# Altium schematic sheet 主板_2.SchDoc
size A4; SheetNumber: 2; SheetTotal: 3
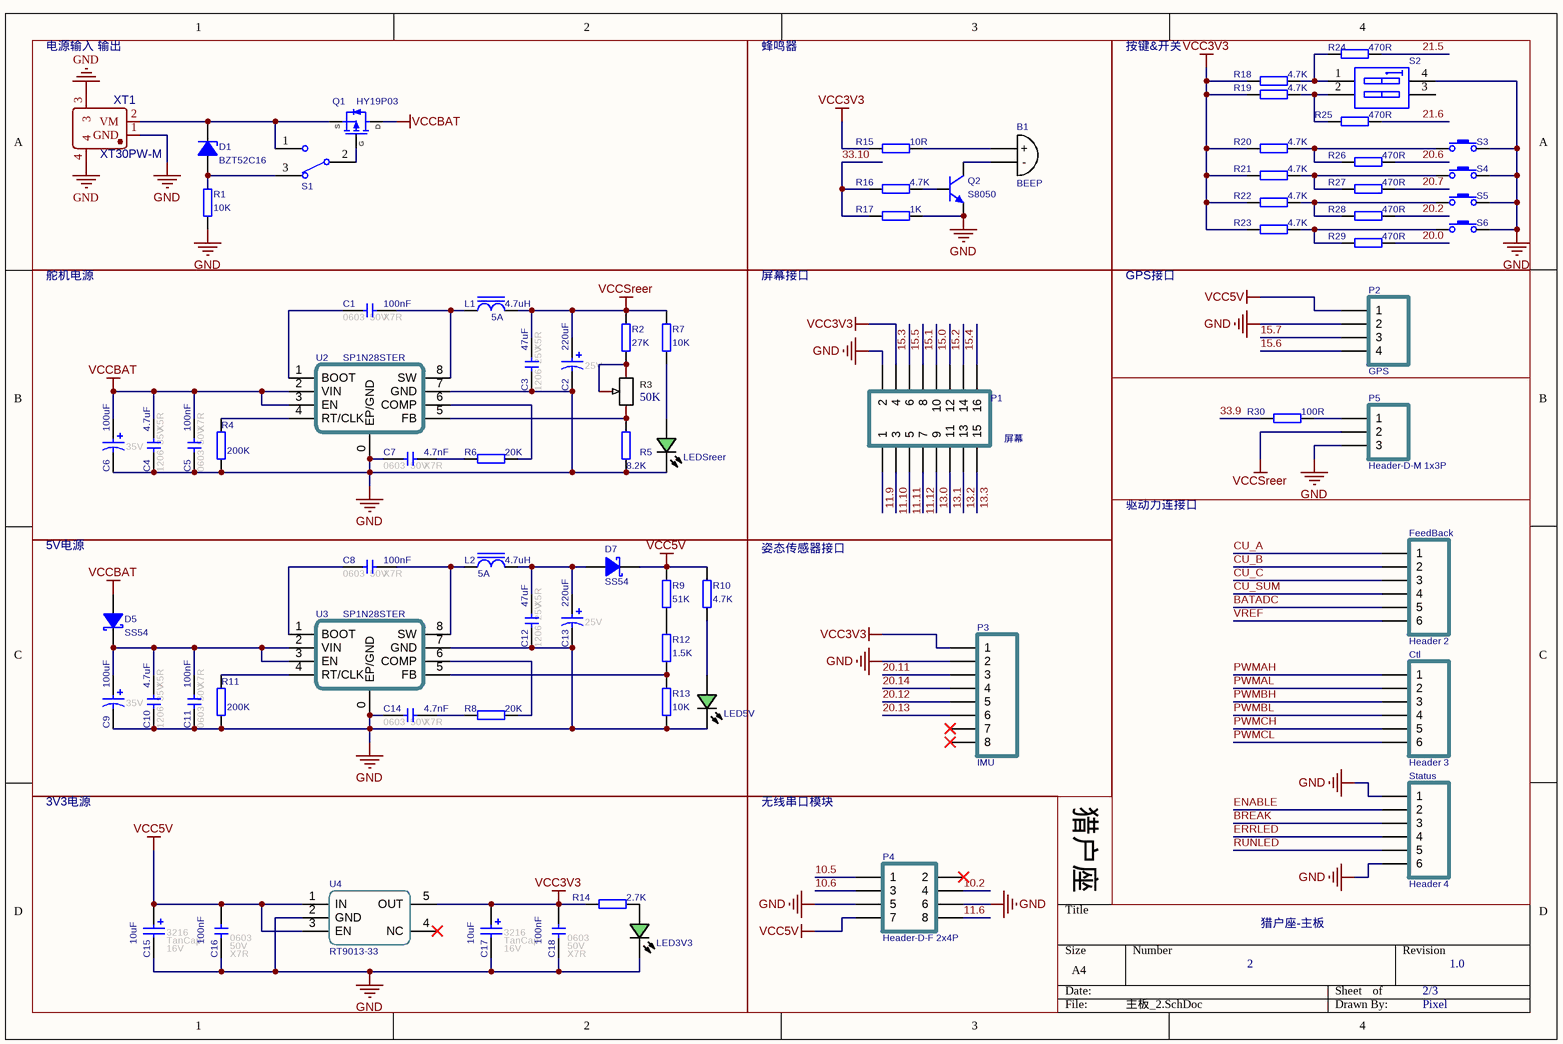
[diagram p0: 主板_2.SchDoc]

## Parts
B1  BEEP  [BEEP 9x5.5mm]
C1  value 100nF  FootPrint: 0603  Voltage: 50V  Type: X7R  [CAPC1608[0603]S-N]  (hidden comment: 100nF 50V X7R)
C2  value 220uF  Voltage: 25V  [CAP-E-S 6.3]  (hidden comment: 220uF 25V 铝电解)
C3  value 47uF  FootPrint: 1206  Voltage: 25V  Type: X5R  [CAPC3216[1206]S]  (hidden comment: 47uF 25V X5R)
C4  value 4.7uF  FootPrint: 1206  Voltage: 35V  Type: X5R  [CAPC3216[1206]S]  (hidden comment: 4.7uF 35V X5R)
C5  value 100nF  FootPrint: 0603  Voltage: 50V  Type: X7R  [CAPC1608[0603]S-N]  (hidden comment: 100nF 50V X7R)
C6  value 100uF  Voltage: 35V  [CAP-E-S 6.3]  (hidden comment: 100uF 35V 铝电解)
C7  value 4.7nF  FootPrint: 0603  Voltage: 50V  Type: X7R  [CAPC1608[0603]S-N]  (hidden comment: 4.7nF 50V X7R)
C8  value 100nF  FootPrint: 0603  Voltage: 50V  Type: X7R  [CAPC1608[0603]S-N]  (hidden comment: 100nF 50V X7R)
C9  value 100uF  Voltage: 35V  [CAP-E-S 6.3]  (hidden comment: 100uF 35V 铝电解)
C10  value 4.7uF  FootPrint: 1206  Voltage: 35V  Type: X5R  [CAPC3216[1206]S]  (hidden comment: 4.7uF 35V X5R)
C11  value 100nF  FootPrint: 0603  Voltage: 50V  Type: X7R  [CAPC1608[0603]S-N]  (hidden comment: 100nF 50V X7R)
C12  value 47uF  FootPrint: 1206  Voltage: 25V  Type: X5R  [CAPC3216[1206]S]  (hidden comment: 47uF 25V X5R)
C13  value 220uF  Voltage: 25V  [CAP-E-S 6.3]  (hidden comment: 220uF 25V 铝电解)
C14  value 4.7nF  FootPrint: 0603  Voltage: 50V  Type: X7R  [CAPC1608[0603]S-N]  (hidden comment: 4.7nF 50V X7R)
C15  value 10uF  FootPrint: 3216  Type: TanCap  Voltage: 16V  [CAP-T-S 3216]  (hidden comment: 10uF 16V 钽电容)
C16  value 100nF  FootPrint: 0603  Voltage: 50V  Type: X7R  [CAPC1608[0603]S-N]  (hidden comment: 100nF 50V X7R)
C17  value 10uF  FootPrint: 3216  Type: TanCap  Voltage: 16V  [CAP-T-S 3216]  (hidden comment: 10uF 16V 钽电容)
C18  value 100nF  FootPrint: 0603  Voltage: 50V  Type: X7R  [CAPC1608[0603]S-N]  (hidden comment: 100nF 50V X7R)
Ctl  Header 3  [ZH1.5-6P-SH]
D1  BZT52C16  [SOD-123-L]
D5  SS54  [SMA-L[DO-214AC]]
D7  SS54  [SMA-L[DO-214AC]]
FeedBack  Header 2  [ZH1.5-6P-SH]
L1  value 4.7uH  Imax: 5A  [0630 TPC 7*7*3]  (hidden comment: 4.7uH 5A)
L2  value 4.7uH  Imax: 5A  [0630 TPC 7*7*3]  (hidden comment: 4.7uH 5A)
LED3V3  翠绿贴片LED  [LEDC1608(0603)-L]  (value not drawn)
LED5V  翠绿贴片LED  [LEDC1608(0603)-L]  (value not drawn)
LEDSreer  翠绿贴片LED  [LEDC1608(0603)-L]  (value not drawn)
P1  屏幕  [HDR2X8-F]
P2  GPS  [HDR1X4-M]
P3  IMU  [HDR1X8-M]
P4  Header-D-F 2x4P  [HDR2X4-F]
P5  Header-D-M 1x3P  [HDR1X3-M]
Q1  HY19P03  [TO-252AA]
Q2  S8050  [SOT-23]
R1  value 10K  [RESC1608[0603]S-N]  (hidden comment: 10K ±1%)
R2  value 27K  [RESC1608[0603]S-N]  (hidden comment: 27K ±1%)
R3  3362P-1-503  [RES-ADJ-TH_3P-L7.1-W6.9-P2.50-L_3362P]  (value not drawn)
R4  value 200K  [RESC1608[0603]S-N]  (hidden comment: 200K ±1%)
R5  value 8.2K  [RESC1608[0603]S-N]  (hidden comment: 8.2K ±1%)
R6  value 20K  [RESC1608[0603]S-N]  (hidden comment: 20K ±1%)
R7  value 10K  [RESC1608[0603]S-N]  (hidden comment: 10K ±1%)
R8  value 20K  [RESC1608[0603]S-N]  (hidden comment: 20K ±1%)
R9  value 51K  [RESC1608[0603]S-N]  (hidden comment: 51K ±1%)
R10  value 4.7K  [RESC1608[0603]S-N]  (hidden comment: 4.7K ±1%)
R11  value 200K  [RESC1608[0603]S-N]  (hidden comment: 200K ±1%)
R12  value 1.5K  [RESC1608[0603]S-N]  (hidden comment: 1.5K ±1%)
R13  value 10K  [RESC1608[0603]S-N]  (hidden comment: 10K ±1%)
R14  value 2.7K  [RESC1608[0603]S-N]  (hidden comment: 2.7K ±1%)
R15  value 10R  [RESC1608[0603]S-N]  (hidden comment: 10R ±1%)
R16  value 4.7K  [RESC1608[0603]S-N]  (hidden comment: 4.7K ±1%)
R17  value 1K  [RESC1608[0603]S-N]  (hidden comment: 1K ±1%)
R18  value 4.7K  [RESC1608[0603]S-N]  (hidden comment: 4.7K ±1%)
R19  value 4.7K  [RESC1608[0603]S-N]  (hidden comment: 4.7K ±1%)
R20  value 4.7K  [RESC1608[0603]S-N]  (hidden comment: 4.7K ±1%)
R21  value 4.7K  [RESC1608[0603]S-N]  (hidden comment: 4.7K ±1%)
R22  value 4.7K  [RESC1608[0603]S-N]  (hidden comment: 4.7K ±1%)
R23  value 4.7K  [RESC1608[0603]S-N]  (hidden comment: 4.7K ±1%)
R24  value 470R  [RESC1608[0603]S-N]  (hidden comment: 470R ±1%)
R25  value 470R  [RESC1608[0603]S-N]  (hidden comment: 470R ±1%)
R26  value 470R  [RESC1608[0603]S-N]  (hidden comment: 470R ±1%)
R27  value 470R  [RESC1608[0603]S-N]  (hidden comment: 470R ±1%)
R28  value 470R  [RESC1608[0603]S-N]  (hidden comment: 470R ±1%)
R29  value 470R  [RESC1608[0603]S-N]  (hidden comment: 470R ±1%)
R30  value 100R  [RESC1608[0603]S-N]  (hidden comment: 100R ±1%)
S1  SW-SPDT  [SS12D10]  (value not drawn)
S2  SW DIP-2  [Code SW-2-DIP-2.54]  (value not drawn)
S3  Button  [PTS810-3*4-CurvePin]  (value not drawn)
S4  Button  [PTS810-3*4-CurvePin]  (value not drawn)
S5  Button  [PTS810-3*4-CurvePin]  (value not drawn)
S6  Button  [PTS810-3*4-CurvePin]  (value not drawn)
Status  Header 4  [ZH1.5-6P-SH]
U2  SP1N28STER  [SOP-8E]
U3  SP1N28STER  [SOP-8E]
U4  RT9013-33  [SOT-23-5]
XT1  XT30PW-M  [XT30PW-M]

## Blocks framed on the sheet
电源输入 输出: D1 Q1 R1 S1 XT1
蜂鸣器: B1 Q2 R15-R17
按键&开关: R18-R29 S2-S6
舵机电源: C1-C7 L1 LEDSreer R2-R7 U2
屏幕接口: P1
GPS接口: P2 P5 R30
驱动力连接口: Ctl FeedBack Status
5V电源: C8-C14 D5 D7 L2 LED5V R8-R13 U3
姿态传感器接口: P3
3V3电源: C15-C18 LED3V3 R14 U4
无线串口模块: P4

## Nets
GND: C2.2 C3.1 C4.1 C5.1 C6.2 C7.1 C9.2 C10.1 C11.1 C12.1 C13.2 C14.1 C15.2 C16.1 C17.2 C18.1 LED3V3.C LED5V.C LEDSreer.C P1.2 P2.2 P3.2 P4.5 P4.6 P5.3 Q2.2(E) R1.1 R4.1 R5.1 R11.1 R13.1 R17.2 S2.4(B1) S3.1 S4.1 S5.1 S6.1 Status.1 Status.6 U2.0(EP/GND) U2.7(GND) U3.0(EP/GND) U3.7(GND) U4.2(GND) XT1.1(GND) XT1.3 XT1.4
VCC3V3: C17.1 C18.2 P1.4 P3.1 R14.1 R15.1 R18.1 R19.1 R20.1 R21.1 R22.1 R23.1 U4.5(OUT)
VCC5V: C15.1 C16.2 D7.K P2.1 P4.7 R9.2 R10.2 U4.1(IN) U4.3(EN)
VCCBAT: C4.2 C5.2 C6.1 D5.A Q1.1(D) U2.2(VIN) U2.3(EN)
VCCSreer: C2.1 C3.2 L1.2 P5.2 R2.2 R7.2
10.2: P4.4
10.5: P4.1
10.6: P4.3
11.6: P4.8
11.9: P1.1
11.10: P1.3
11.11: P1.5
11.12: P1.7
13.0: P1.9
13.1: P1.11
13.2: P1.13
13.3: P1.15
15.0: P1.12
15.1: P1.10
15.2: P1.14
15.3: P1.6
15.4: P1.16
15.5: P1.8
15.6: P2.4
15.7: P2.3
20.0: R29.2
20.2: R28.2
20.6: R26.2
20.7: R27.2
20.11: P3.3
20.12: P3.5
20.13: P3.6
20.14: P3.4
21.5: R24.2
21.6: R25.2
33.9: R30.1
33.10: R16.1 R17.1
BATADC: FeedBack.5
BREAK: Status.3
CU_A: FeedBack.1
CU_B: FeedBack.2
CU_C: FeedBack.3
CU_SUM: FeedBack.4
ENABLE: Status.2
ERRLED: Status.4
PWMAH: Ctl.1
PWMAL: Ctl.2
PWMBH: Ctl.3
PWMBL: Ctl.4
PWMCH: Ctl.5
PWMCL: Ctl.6
RUNLED: Status.5
VREF: FeedBack.6
NetB1_1: B1.1(+) R15.2
NetB1_2: B1.2(-) Q2.3(C)
NetC1_1: C1.1 U2.1(BOOT)
NetC1_2: C1.2 L1.1 U2.8(SW)
NetC7_2: C7.2 R6.1
NetC8_1: C8.1 U3.1(BOOT)
NetC8_2: C8.2 L2.1 U3.8(SW)
NetC9_1: C9.1 C10.2 C11.2 D5.K U3.2(VIN) U3.3(EN)
NetC12_2: C12.2 C13.1 D7.A L2.2
NetC14_2: C14.2 R8.1
NetD1_A: D1.A R1.2 S1.3
NetD1_K: D1.K Q1.3(S) S1.1 XT1.2(VM)
NetLED3V3_A: LED3V3.A R14.2
NetLED5V_A: LED5V.A R10.1
NetLEDSreer_A: LEDSreer.A R7.1
NetP5_1: P5.1 R30.2
NetQ1_2: Q1.2(G) S1.2
NetQ2_1: Q2.1(B) R16.2
NetR2_1: R2.1 R3.2 R3.3
NetR3_1: R3.1 R5.2 U2.5(FB)
NetR4_2: R4.2 U2.4(RT/CLK)
NetR6_2: R6.2 U2.6(COMP)
NetR8_2: R8.2 U3.6(COMP)
NetR9_1: R9.1 R12.2
NetR11_2: R11.2 U3.4(RT/CLK)
NetR12_1: R12.1 R13.2 U3.5(FB)
NetR18_2: R18.2 R24.1 S2.1(A1)
NetR19_2: R19.2 R25.1 S2.2(A2)
NetR20_2: R20.2 R26.1 S3.2
NetR21_2: R21.2 R27.1 S4.2
NetR22_2: R22.2 R28.1 S5.2
NetR23_2: R23.2 R29.1 S6.2

Not connected (* = marked no-connect by the designer): P3 7* 8*; P4 2*; S2 3(B2); U4 4(NC)*

## Notes on the sheet
- 猎户座
- 猎户座-主板
- 2
- 2/3
- 1.0
- Pixel
- (in symbol RES-ADJ-50k(10%)) 50K

## Library data of the parts
B1 = BEEP: 蜂鸣器
C1 C5 C8 C11 C16 C18 = 100nF 0603 50V X7R: 贴片瓷片电容; MLCC; 0603(1608);; Revision: V1.0
C2 C13 = E-S 220uF 25V 6.3x7.7: 贴片电解电容 220uF 25V 6.3x7.7; Revision: V1.0; Type: 铝电解
C3 C12 = 47uF 1206 25V X5R: 贴片瓷片电容; MLCC; 1206(3216);; Revision: V1.0
C4 C10 = 4.7uF 1206 35V X5R: 贴片瓷片电容; MLCC; 1206(3216);; Revision: V1.0
C6 C9 = E-S 100uF 35V 6.3x7.7: 贴片电解电容 100uF 35V 6.3x7.7; Revision: V1.0; Type: 铝电解
C7 C14 = 4.7nF 0603 50V X7R: 贴片瓷片电容; MLCC; 0603(1608);; Revision: V1.0
C15 C17 = T-S 10uF 3216 16V: 贴片钽电容 10uF 3216 16V; Revision: July-2002: Re-released for DXP Platform.
Ctl FeedBack Status = Header 6: Header, 6-Pin; System: Connector; LatestRevisionDate: 17-Jul-2002; LatestRevisionNote: Re-released for DXP Platform.; Publisher: Altium Limited; Price(RMB): 0.00
D1 = Diode Zen: 稳压二极管 齐纳二极管  Zener Diode; Published: 8-Jun-2000; Revision: July-2002: Re-released for DXP Platform.; Publisher: Altium Limited; Price(RMB): 0.000
D5 D7 = SS54: SS54 肖特基二极管; Revision: V1.0; Value: SS54
L1 L2 = Ind-Power: 功率电感; DCR: .5m; Published: 8-Jun-2000; Revision: July-2002: Re-released for DXP Platform.; Publisher: Altium Limited; Price(RMB): 0.000
LED3V3 LED5V LEDSreer = LED Chip Green: Published: 8-Jun-2000; Revision: July-2002: Re-released for DXP Platform.; Publisher: Altium Limited; Price(RMB): 0.00
P1 = Header-D-F 2x8P: 2x8pin, 直插, 双排座; Revision: V1.0; Value: 屏幕
P2 = Header-D-M 1x4P: 1x4pin, 直插, 排针; Revision: V1.0; Value: GPS
P3 = Header-D-M 1x8P: 1x8pin, 直插, 排针; Revision: V1.0; Value: IMU
P4 = Header-D-F 2x4P: 2x4pin, 直插, 双排座; Revision: V1.0; Value: Header-D-F 2x4P
P5 = Header-D-M 1x3P: 1x3pin, 直插, 排针; Revision: V1.0; Value: Header-D-M 1x3P
Q1 = HY19P03: HY19P03 P-Channel MOSFET
Q2 = NPN S8050: NPN 三极管; Published: 8-Jun-2000; Revision: July-2002: Re-released for DXP Platform.; Publisher: Altium Limited; Price(RMB): 0.000; PartNumber: S8050
R1 R7 R13 = Res-Chip: 贴片电阻; Power: 1/8W; Revision: V1.0; Tolerance: ±1%
R2 R9 = Res-Chip_7: 贴片电阻; Power: 1/8W; Revision: V1.0; Tolerance: ±1%
R3 = RES-ADJ-50k(10%): Designer: U?; Name: RES-ADJ-50K(10%); Symbol: 3362P-1-503; Device: 3362P-1-503
R4 R11 = Res-Chip_1: 贴片电阻; Power: 1/8W; Revision: V1.0; Tolerance: ±1%
R5 = Res-Chip_8: 贴片电阻; Power: 1/8W; Revision: V1.0; Tolerance: ±1%
R6 R8 = Res-Chip_4: 贴片电阻; Power: 1/8W; Revision: V1.0; Tolerance: ±1%
R10 R16 R18-R23 = Res-Chip_3: 贴片电阻; Power: 1/8W; Revision: V1.0; Tolerance: ±1%
R12 = Res-Chip_5: 贴片电阻; Power: 1/8W; Revision: V1.0; Tolerance: ±1%
R14 = Res-Chip_6: 贴片电阻; Power: 1/8W; Revision: V1.0; Tolerance: ±1%
R15 = Res-Chip_10: 贴片电阻; Power: 1/8W; Revision: V1.0; Tolerance: ±1%
R17 = Res-Chip_11: 贴片电阻; Power: 1/8W; Revision: V1.0; Tolerance: ±1%
R24-R29 = Res-Chip_12: 贴片电阻; Power: 1/8W; Revision: V1.0; Tolerance: ±1%
R30 = Res-Chip_9: 贴片电阻; Power: 1/8W; Revision: V1.0; Tolerance: ±1%
S1 = SW-SPDT: 单刀双掷开关 3脚船型、钮子、拨动开关 SPDT Subminiature Toggle Switch; Published: 24-Mar-1999; Publisher: Altium Limited; Price(RMB): 0.000
S2 = Code SW-2: 2位拨码开关; Published: 24-Mar-1999; Revision: July-2002: Re-released for DXP Platform.; Publisher: Altium Limited; Price(RMB): 0.000
S3-S6 = KEY: 按键; Published: 24-Mar-1999; Publisher: Altium Limited; Price(RMB): 0.000
U4 = RT9013-33: 3.3V 500mA SOT-23-5 LDO
U2 U3 = SP1N28STER: Revision: V1.0; Value: SP1N28STER